# EAGLE design clack_beam_V (EAGLE 9.6.2)
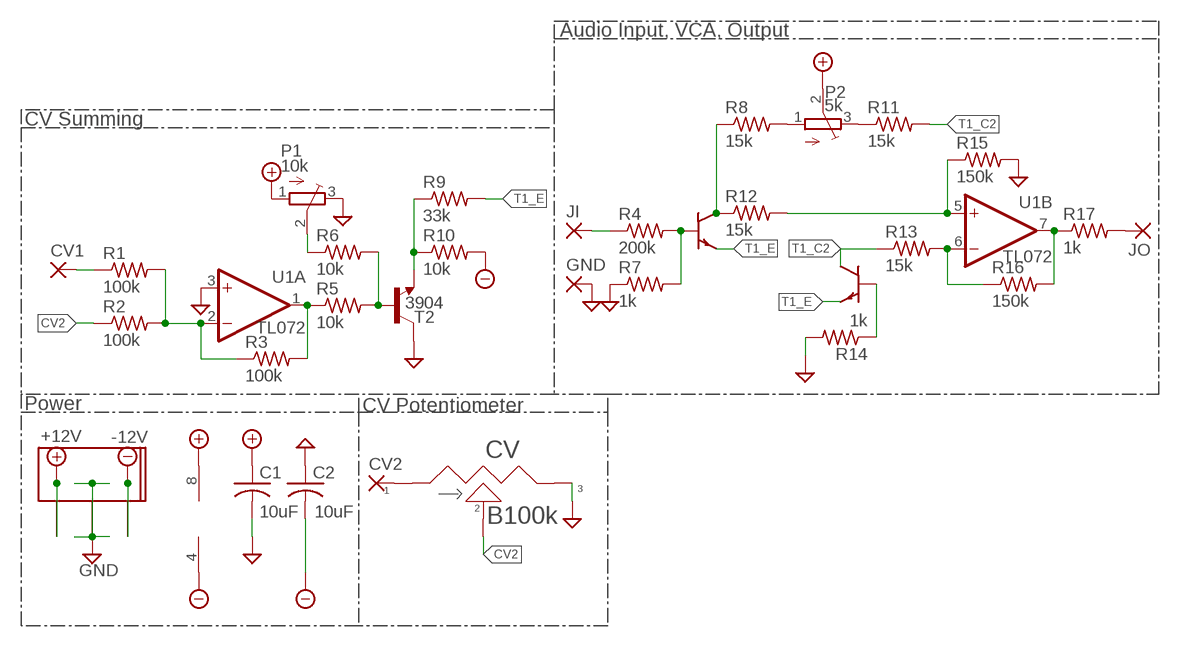
[diagram p0: schematic, sheet 1]

## Parts
C1  10uF  C-USC1206  [C1206]
C2  10uF  C-USC1206  [C1206]
CV  B100k  POT_9MM_SMD  [POT_9MM_SMD]
CV1  WIREPADSMD1,27-254  [SMD1,27-2,54]
CV2  WIREPADSMD1,27-254  [SMD1,27-2,54]
GND  WIREPADSMD1,27-254  [SMD1,27-2,54]
JI  WIREPADSMD1,27-254  [SMD1,27-2,54]
JO  WIREPADSMD1,27-254  [SMD1,27-2,54]
P1  10k  TRIMPOTTC33X  [TC33X]
P2  5k  TRIMPOTTC33X  [TC33X]
R1  100k  R-US_R0603  [R0603]
R2  100k  R-US_R0603  [R0603]
R3  100k  R-US_R0603  [R0603]
R4  200k  R-US_R0603  [R0603]
R5  10k  R-US_R0603  [R0603]
R6  10k  R-US_R0603  [R0603]
R7  1k  R-US_R0603  [R0603]
R8  15k  R-US_R0603  [R0603]
R9  33k  R-US_R0603  [R0603]
R10  10k  R-US_R0603  [R0603]
R11  15k  R-US_R0603  [R0603]
R12  15k  R-US_R0603  [R0603]
R13  15k  R-US_R0603  [R0603]
R14  1k  R-US_R0603  [R0603]
R15  150k  R-US_R0603  [R0603]
R16  150k  R-US_R0603  [R0603]
R17  1k  R-US_R0603  [R0603]
T1  MBT3904DW1  [MBT3904DW1T1G]
T2  3904  MMBT3904LT1-NPN-SOT23-BEC  [SOT23-BEC]
U1  TL072  TL072TSSOP  [TSSOP-8]
U$1  EURO_POW_SMD  [EURO_POW_SMD]

## Nets
1AI-: R1.2 R2.2 R3.1 U1.2(A:-IN)
1AO: R3.2 R5.1 U1.1(A:OUT)
2_AI-: R13.2 R16.1 U1.6(B:-IN)
2AI+: R12.2 R15.1 U1.5(B:+IN)
2AO: R16.2 R17.1 U1.7(B:OUT)
+12V: C1.1 P1.1(A) P2.2(S) U1.8(P:V+) U$1.P$9 U$1.P$10
-12V: C2.2 R10.2 U1.4(P:V-) U$1.P$1 U$1.P$2
CV1: CV1.1(P) R1.1
CV2: CV.2 R2.1
CV2_I: CV2.1(P) CV.1
GND: C1.2 C2.1 CV.3 GND.1(P) P1.3(E) R7.1 R14.2 R15.2 T2.C U1.3(A:+IN) U$1.P$3 U$1.P$4 U$1.P$5 U$1.P$6 U$1.P$7 U$1.P$8
JI: JI.1(P) R4.1
JO: JO.1(P) R17.2
N$5: P1.2(S) R6.1
N$10: P2.1(A) R8.2
N$11: P2.3(E) R11.1
T1_B1: R4.2 R7.2 T1.5(T$1:B)
T1_B2: R14.1 T1.2(T$2:B)
T1_C1: R8.1 R12.1 T1.3(T$1:C)
T1_C2: R11.2 R13.1 T1.6(T$2:C)
T1_E: R9.2 T1.1(T$2:E) T1.4(T$1:E)
T2_B: R5.2 R6.2 T2.B
T2_E: R9.1 R10.1 T2.E

## Notes on the sheet
- Audio Input, VCA, Output
- CV Summing
- Power | CV Potentiometer
- CV
- B100k

## Library data of the parts
C1 C2 = adafruit:C-US: CAPACITOR, American symbol
CV = Potentiometers_SMD:POT_9MM_SMD
CV1 CV2 GND JI JO = wirepad:WIREPAD: Wire PAD connect wire on PCB
P1 P2 = adafruit:TRIMPOT: SMT trimmer potentiometer part number TC33X http://www.ladyada.net/library/eagle
R1-R17 = adafruit:R-US_: RESISTOR, American symbol
T1 = SOT65P210X110-6N:MBT3904DW1
T2 = MusicThingModular:*-NPN-: NPN Transistror BF959 corrected 2008.03.06
U1 = MusicThingModular:TL072: Generic Dual Op Amp
U$1 = 2.54mm_PowHeader_SMD:EURO_POW_SMD

## Board
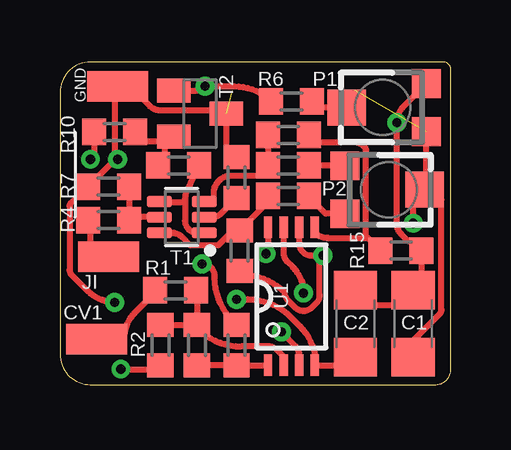
[diagram p1: board, top side]
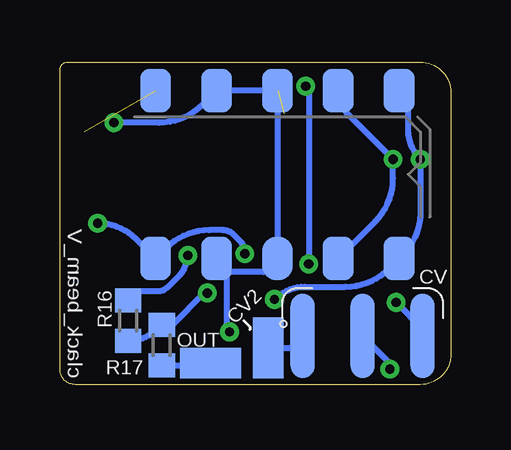
[diagram p2: board, bottom side, seen from below]

Size 16.31 x 13.45 mm. Coordinates in mm from the lower left corner, seen from the top.
Outline: 16.31,0.64 16.31,13.13 arc90 15.99,13.45 1.27,13.45 arc90 0,12.18 0,1.27 arc90 1.27,0 15.67,0 arc90 16.31,0.64
Copper layers (1*16): Top 0.035mm / dielectric 1.5mm / Bottom 0.035mm
Design rules "default *": minimum track width 6mil, minimum drill 0.35mm, track to track 6mil, track to pad 6mil, pad to pad 6mil, via to via 6mil, smd to smd 6mil, copper to edge 10mil, drill to drill 6mil, minimum pad ring 10mil, minimum via ring 8mil, stop-mask expansion 4mil, vias tented up to drill 0mil, thermal gap 10mil

### Footprints (pad centres in the part's own frame; a part is rotated, then mirrored left to right if it is on the bottom)
C1206 = smd 1.6 x 1.8: 1 -1.4,0; 2 1.4,0
POT_9MM_SMD = smd 0.991 x 3.505: 1 -2.5,0; 2 0,0; 3 2.5,0
SMD1,27-2,54 = smd 1.27 x 2.54: 1 0,0
TC33X = smd 1.2 x 1.2: 1 -1,-1.825; 3 1,-1.825 | smd 1.5 x 1.6: 2 0,1.5
R0603 = smd 1 x 1.1: 1 -0.85,0; 2 0.85,0
MBT3904DW1T1G = smd 1.048 x 0.472: 1 -0.941,0.65; 2 -0.941,0; 3 -0.941,-0.65; 4 0.941,-0.65; 5 0.941,0; 6 0.941,0.65
SOT23-BEC = smd 1 x 1.4: B -0.95,-1.1; C 0,1.1; E 0.95,-1.1
TSSOP-8 = smd 0.9 x 0.35: 1 -2.875,0.975; 2 -2.875,0.325; 3 -2.875,-0.325; 4 -2.875,-0.975; 5 2.875,-0.975; 6 2.875,-0.325; 7 2.875,0.325; 8 2.875,0.975
EURO_POW_SMD = smd 1.27 x 1.8: P$1 5.08,3.5; P$2 5.08,-3.5; P$3 2.54,3.5; P$4 2.54,-3.5; P$5 0,3.5; P$6 0,-3.5; P$7 -2.54,3.5; P$8 -2.54,-3.5; P$9 -5.08,3.5; P$10 -5.08,-3.5

### Placement (x,y rotation side)
C1  14.73,2.54 90 top
C2  12.32,2.54 270 top
CV  3.68,2.03 0 bottom
CV1  1.52,1.91 270 top
CV2  7.62,1.52 180 bottom
GND  2.41,12.45 90 top
JI  2.03,5.33 90 top
JO  10.03,0.89 90 bottom
P1  13.46,11.56 90 top
P2  13.72,8.13 270 top
R1  4.83,3.94 0 top
R2  4.19,1.65 90 top
R3  5.71,1.65 270 top
R4  2.03,6.86 0 top
R5  7.37,1.65 90 top
R6  9.65,11.81 180 top
R7  2.03,8.26 0 top
R8  9.53,9.14 0 top
R9  4.95,9.14 0 top
R10  2.29,10.54 180 top
R11  9.53,7.87 180 top
R12  9.53,10.41 0 top
R13  7.49,5.59 270 top
R14  7.37,8.64 90 top
R15  14.22,5.59 0 top
R16  13.46,2.67 270 bottom
R17  12.06,1.65 270 bottom
T1  5.08,6.99 180 top
T2  5.84,11.3 270 top
U1  9.65,3.68 90 top
U$1  7.24,8.76 0 bottom

### Tracks (layer width: path | path; a pad name or v marks a point on that pad's centre or on a via)
1AI-
  Top 0.254: R2.2 R3.1 | R1.2 5.71,3.9 R3.1 | R3.1 5.71,2.37 5.75,2.34 arc45 7.55,1.59 8.7,1.59 arc-45 9.06,1.45 9.33,1.18 U1.2
1AO
  Top 0.254: U1.1 R5.1 R3.2
2_AI-  (via drill 0.38)
  Top 0.254: U1.6 9.98,5.9 arc90 10.48,5.39 v10.97,5.39 arc45 10.83,5.05 10.83,3.75 arc-45 10.68,3.39 10.52,3.22 arc-90 9.8,3.22 9.51,3.52 arc-45 9.37,3.86 arc45 7.67,4.56 R13.2
  Bottom 0.254: v10.97,5.39 11.02,5.34 arc45 11.37,4.51 11.79,4.08 arc45 12.24,3.9 13.08,3.9 R16.1
2AI+
  Top 0.254: U1.5 10.61,6.54 10.61,6.36 arc45 11.18,6.12 12.84,6.12 R15.1 12.77,6.19 12.77,9.74 arc45 12.7,9.92 12.66,9.95 arc45 12.3,10.1 10.69,10.1 R12.2
2AO  (via drill 0.38)
  Top 0.254: U1.7 9.33,5.5 arc45 9.48,5.14 9.71,4.9 arc-45 v10.16,3.82
  Bottom 0.254: v10.16,3.82 10.29,3.82 11.6,2.5 R17.1 12.24,2.32 arc45 R16.2
+12V  (via drill 0.38)  (1 unrouted)
  Top 0.254: P2.2 15.29,8.2 P1.1 | v14.73,6.73 14.73,7.64 P2.2 | C1.1 14.73,1.84 15.84,2.95 arc45 15.91,3.13 15.91,7.71 15.49,8.13 P2.2 | U1.8 8.68,5.64 arc-45 v8.6,5.47 v8.6,5.46
  Bottom 0.254: v14.73,6.73 arc45 13.12,6.06 U$1.P$10 11.88,5.7 arc45 10.09,6.44 9.51,6.44 arc45 9.06,6.26 8.78,5.97 arc45 8.6,5.53 v8.6,5.46
-12V  (via drill 0.38)
  Top 0.254: C2.2 11.94,0.76 11.68,0.76 11.64,0.81 U1.4 10.67,0.85 arc45 10.01,2.44 9.63,2.81 arc45 7.84,3.56 v7.37,3.56 | R10.2 1.44,9.8 arc-45 v1.27,9.4
  Bottom 0.254: U$1.P$1 1.78,12.26 1.78,10.62 arc-45 v1.27,9.4 1.27,7.2 arc45 2.01,5.41 U$1.P$2 2.59,4.83 arc45 4.39,4.08 6.09,4.08 arc-45 v7.37,3.56
CV1
  Top 0.254: R1.1 3.98,3.85 3.12,2.99 arc45 2.67,1.91 CV1.1
CV2  (via drill 0.38)
  Top 0.254: v2.54,0.65 4.04,0.65 R2.1
  Bottom 0.254: CV.2 2.54,0.89 v2.54,0.65
CV2_I
  Bottom 0.254: CV2.1 6.69,1.52 CV.1
GND  (via drill 0.38)  (1 unrouted)
  Top 0.254: 2.47,12.39 GND.1 2.85,12.01 | 2.85,12.01 2.29,12.01 2.29,9.71 arc45 v2.41,9.4 2.33,9.4 R7.1 1.13,8.26 0.46,7.58 arc45 0.4,7.44 0.4,4.8 arc45 0.5,4.57 1.18,3.89 arc45 v2.29,3.43 | 2.85,12.01 3.37,12.01 3.76,11.62 arc45 4.21,11.43 6.82,11.43 T2.C 6.94,9.91 R14.2 | C2.1 12.95,3.31 14.1,3.31 C1.2 15.07,4.28 R15.2 14.73,5.93 arc-45 14.47,6.04 14.24,6.27 arc-45 14.06,6.71 v14.06,10.92 arc-45 14.35,11.62 P1.3 | 10.03,0.86 U1.3 9.98,1.24 arc45 9.83,1.6 v9.23,2.2
  Bottom 0.254: v9.23,2.2 9.36,2.32 9.36,4.7 | U$1.P$8 9.78,5.12 9.36,4.7 | 9.36,4.7 7.8,4.7 U$1.P$6 U$1.P$5 | 4.92,12.26 U$1.P$3 arc-45 4.29,11.28 v2.41,9.4 2.41,8.6 arc45 3.16,6.8 U$1.P$4 | 7.19,12.26 U$1.P$5 | v14.06,10.92 12.17,10.92 arc-45 10.38,11.67 U$1.P$7 U$1.P$5 | CV.3 1.18,2.33 v2.29,3.43
JI
  Top 0.254: R4.1 1.27,6.77 1.27,5.46 1.4,5.33 JI.1
JO
  Bottom 0.254: R17.2 10.12,0.8 JO.1
N$5
  Top 0.254: R6.1 10.5,11.73 10.68,11.56 P1.2
N$10
  Top 0.254: P2.1 11.88,9.14 R8.2
N$11
  Top 0.254: P2.3 11.08,7.13 10.38,7.83 R11.1
T1_B1
  Top 0.254: R7.2 2.88,6.99 | 2.88,6.99 R4.2 | T1.5 2.88,6.99
T1_B2
  Top 0.254: T1.2 6.36,6.99 arc45 6.71,7.13 R14.1
T1_C1
  Top 0.254: R12.1 R8.1 8.23,8.7 7.1,8.7 arc45 6.65,8.52 6.6,8.46 arc45 6.41,8.01 6.41,7.53 6.12,7.53 T1.3
T1_C2
  Top 0.254: R11.2 8.68,7.62 R13.1 7.22,6.44 6.61,5.82 5.44,5.82 5.11,6.15 arc45 4.66,6.33 T1.6
T1_E
  Top 0.254: R9.2 5.28,8.03 arc25 5.22,7.76 5.22,7.62 | 5.22,7.62 5.22,6.84 arc90 5.72,6.33 T1.1 | T1.4 4.15,7.62 5.22,7.62
T2_B  (via drill 0.38)
  Top 0.254: T2.B 5.59,12.25 arc45 v6.06,12.45 7.27,12.45 arc-45 R6.2 | R5.2 7.2,2.67 arc-45 6.46,4.46 6.46,4.53 arc90 5.95,5.03 v5.93,5.03
  Bottom 0.254: v5.93,5.03 5.93,12.32 v6.06,12.45
T2_E
  Top 0.254: R10.1 3.52,10.16 4.32,10.16 | T2.E 4.55,10.16 4.32,10.16 | R9.1 4.36,9.4 4.36,10.12 4.32,10.16

### Text on the board
tPlace: GND
bPlace: CV2 | OUT | clack_beam_V